# EAGLE design ControlBoard (EAGLE 8.0.1)
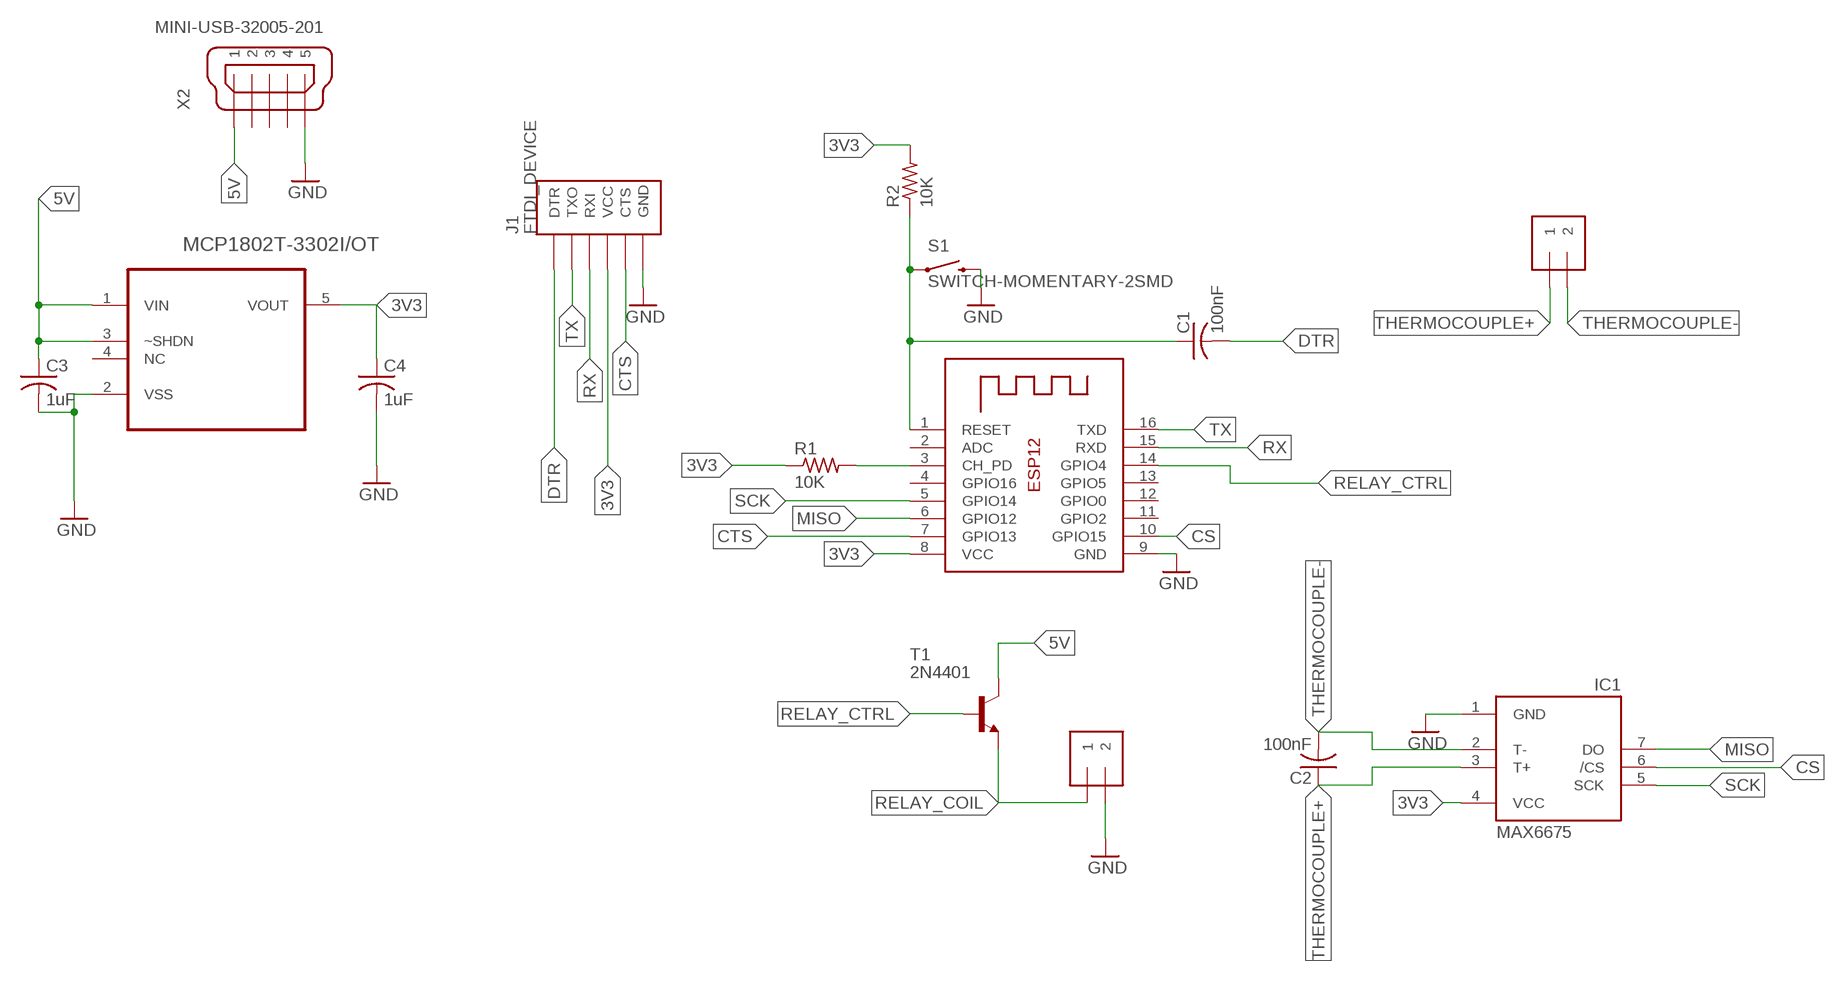
[diagram p0: schematic, sheet 1]

## Parts
C1  100nF  C-USC0603  [C0603]
C2  100nF  C-USC0603  [C0603]
C3  1uF  C-USC0603  [C0603]
C4  1uF  C-USC0603  [C0603]
IC1  MAX6675  [SO08]
J1  FTDI_DEVICE  [FTDI_DEVICE_SIDE]
J2  1X2-3.5MM  [1X2-3.5MM]
J3  1X2-3.5MM  [1X2-3.5MM]
MCP1802T-3302I/OT  MCP1802T-3002I/OT  [SOT95P270X145-5N]
R1  10K  R-US_R0603  [R0603]
R2  10K  R-US_R0603  [R0603]
S1  SWITCH-MOMENTARY-2SMD  [TACTILE-SWITCH-SMD]
T1  2N4401  -NPN-TO92-EBC  [TO92-EBC]
X1  ESP-12  [ESP-12]
X2  MINI-USB-32005-201  [32005-201]

## Nets
3V3: C4.1 IC1.4(VCC) J1.P$4(VCC) MCP1802T-3302I/OT.5(VOUT) R1.1 R2.2 X1.8(VCC)
5V: C3.1 MCP1802T-3302I/OT.1(VIN) MCP1802T-3302I/OT.3(~SHDN) T1.C X2.1
CH_PD: R1.2 X1.3(CH_PD)
CS: IC1.6(/CS) X1.10(GPIO15)
CTS: J1.P$5(CTS) X1.7(GPIO13)
DTR: C1.2 J1.P$1(DTR)
GND: C3.2 C4.2 IC1.1(GND) J1.P$6(GND) J3.2 MCP1802T-3302I/OT.2(VSS) S1.3 X1.9(GND) X2.5
MISO: IC1.7(DO) X1.6(GPIO12)
RELAY_COIL: J3.1 T1.E
RELAY_CTRL: T1.B X1.14(GPIO4)
RST: C1.1 R2.1 S1.1 X1.1(RESET)
RX: J1.P$3(RXI) X1.15(RXD)
SCK: IC1.5(SCK) X1.5(GPIO14)
THERMOCOUPLE+: C2.1 IC1.3(T+) J2.1
THERMOCOUPLE-: C2.2 IC1.2(T-) J2.2
TX: J1.P$2(TXO) X1.16(TXD)
Unconnected: MCP1802T-3302I/OT.4(NC) X1.2(ADC) X1.4(GPIO16) X1.11(GPIO2) X1.12(GPIO0) X1.13(GPIO5) X2.2 X2.3 X2.4

## Library data of the parts
C1-C4 = rcl:C-US: CAPACITOR, American symbol
IC1 = adafruit:MAX6675
J1 = quad:FTDI_DEVICE: Connector which mates to FTDI basic or FTDI cable.
J2 J3 = adafruit:1X2: 3.5mm Terminal block http://www.ladyada.net/library/pcb/eaglelibrary.html
MCP1802T-3302I/OT = quad:MCP1802T-3002I/OT: Low Quiescent Current LDO; MPN: MCP1802T-3002I/OT; OC_FARNELL: 1578373; OC_NEWARK: 54M4837; PACKAGE: SOT-5; SUPPLIER: Microchip
R1 R2 = rcl:R-US_: RESISTOR, American symbol
S1 = quad:SWITCH-MOMENTARY-2: Various NO switches- pushbuttons, reed, etc; PROD_ID: SWCH-08247
T1 = transistor:*-NPN-: NPN Transistror BF959 corrected 2008.03.06
X1 = adafruit:ESP-12
X2 = con-cypressindustries:MINI-USB-: MINI USB-B Conector Source: www.cypressindustries.com; OC_FARNELL: unknown; OC_NEWARK: unknown

## Board
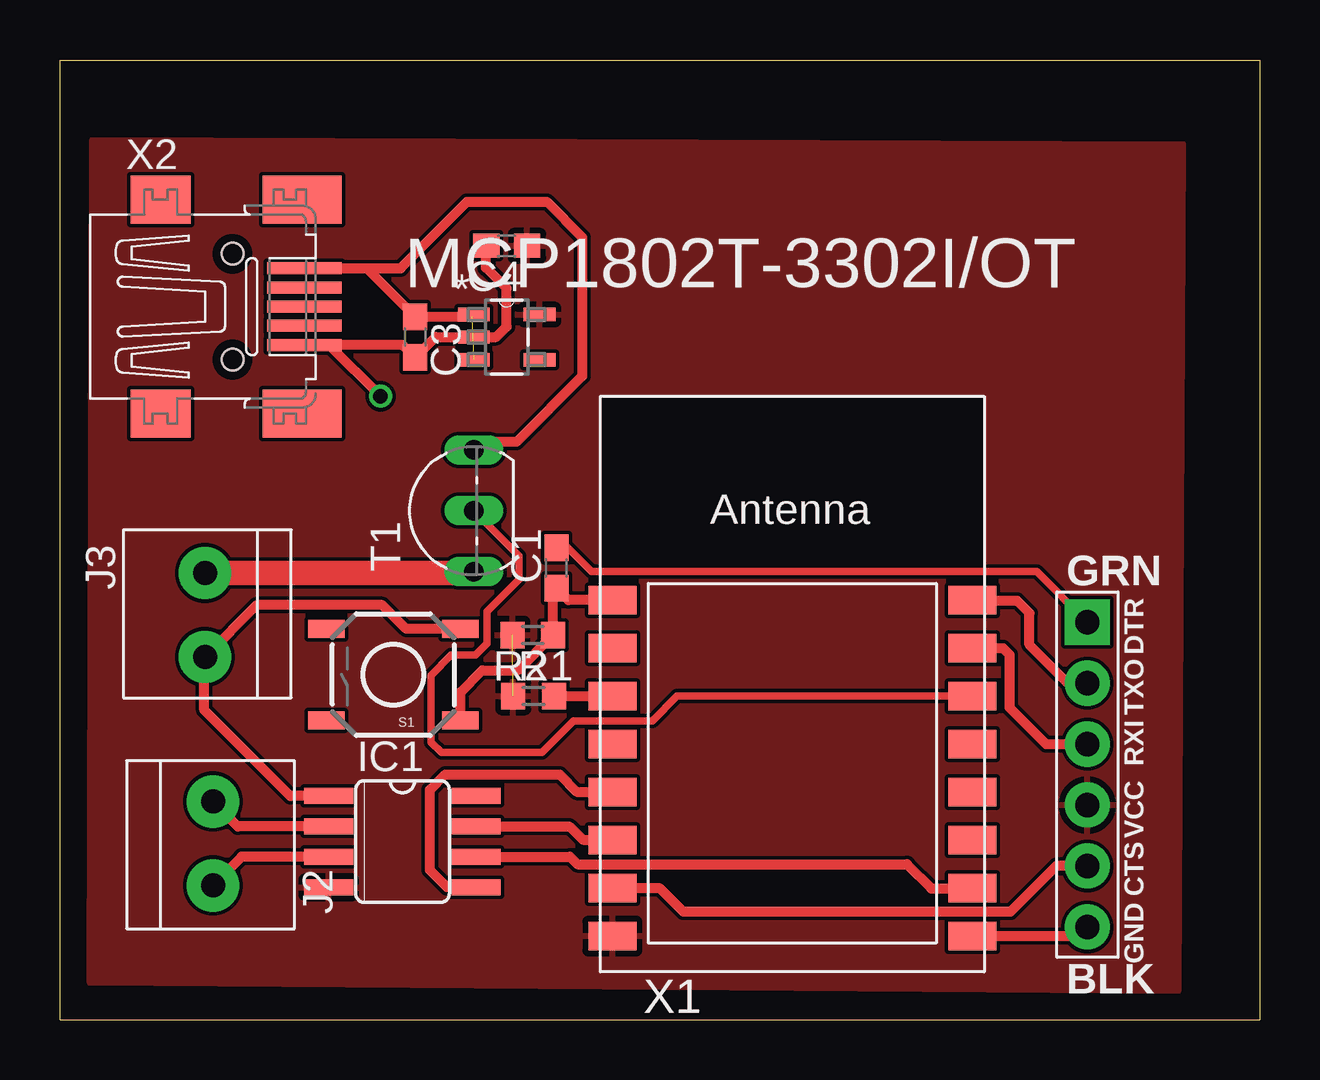
[diagram p1: board, top side]
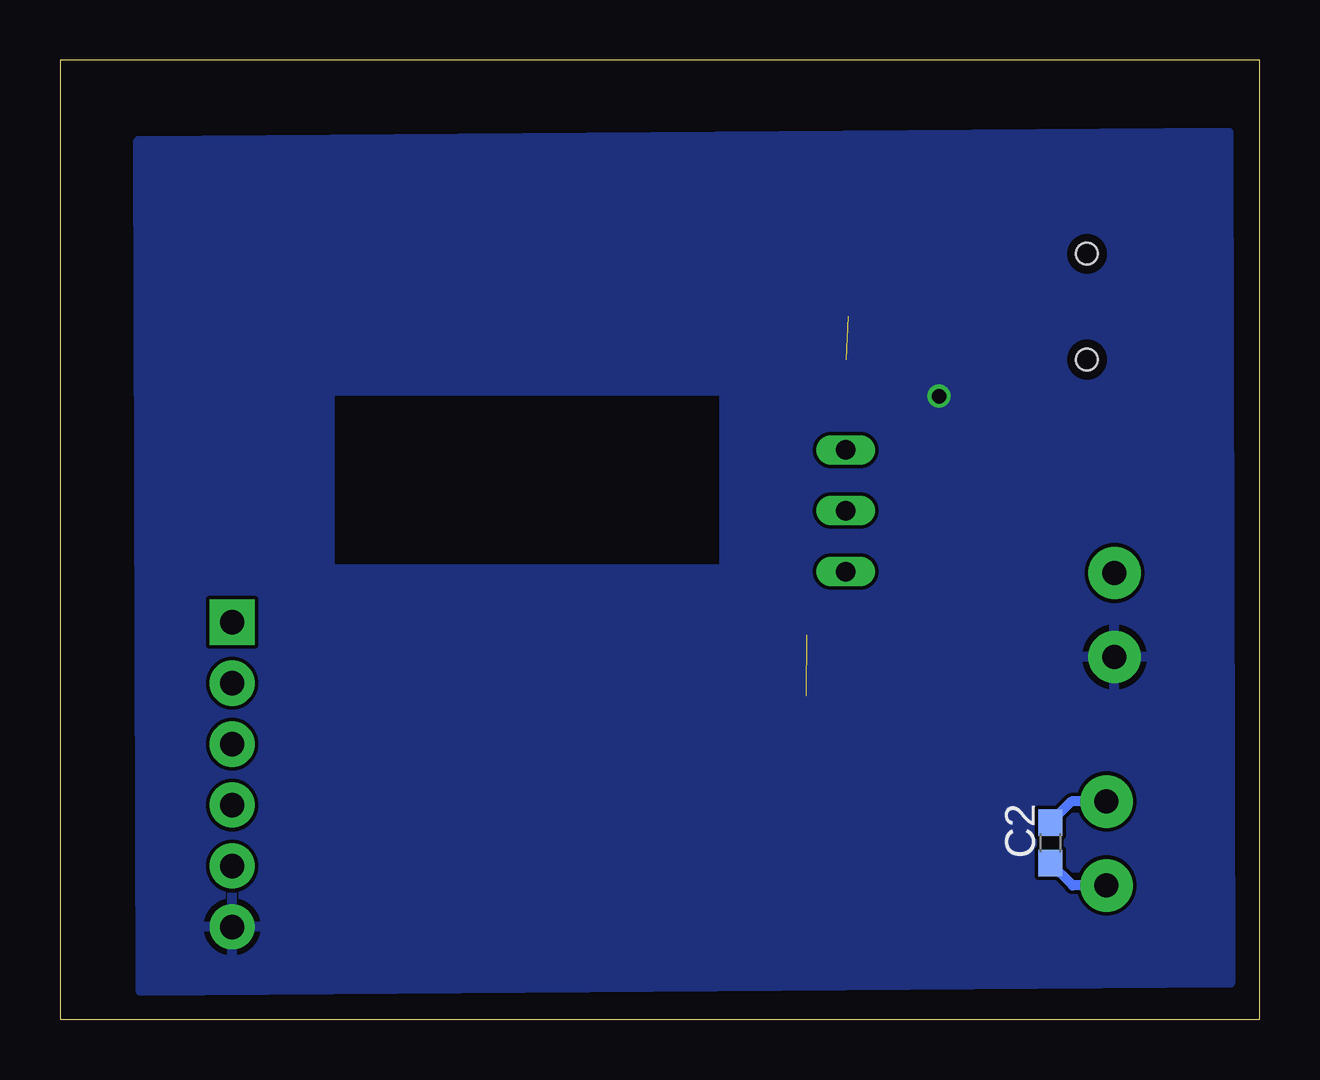
[diagram p2: board, bottom side, seen from below]

Size 50 x 40 mm. Coordinates in mm from the lower left corner, seen from the top.
Outline: 0,0 0,40 50,40 50,0 0,0
Copper layers (1*16): Top 0.0356mm / dielectric 1.5011mm / Bottom 0.0356mm
Design rules "LaenPCBOrder": minimum track width 6mil, minimum drill 13mil, track to track 6mil, track to pad 6mil, pad to pad 6mil, via to via 6mil, smd to smd 6mil, copper to edge 15mil, drill to drill 6mil, minimum pad ring 7mil, minimum via ring 7mil, stop-mask expansion 3mil, vias tented up to drill 0mil, thermal gap 10mil

### Footprints (pad centres in the part's own frame; a part is rotated, then mirrored left to right if it is on the bottom)
C0603 = smd 1.1 x 1: 1 -0.85,0; 2 0.85,0
SO08 = smd 0.66 x 2.032: 1 -1.905,-3.073; 2 -0.635,-3.073; 3 0.635,-3.073; 4 1.905,-3.073; 5 1.905,3.073; 6 0.635,3.073; 7 -0.635,3.073; 8 -1.905,3.073
FTDI_DEVICE_SIDE = drill 1.016 pad 1.88 square: P$1 -6.35,0 | drill 1.016 pad 1.88: P$2 -3.81,0; P$3 -1.27,0; P$4 1.27,0; P$5 3.81,0; P$6 6.35,0
1X2-3.5MM = drill 1 pad 2.184: 1 1.8,0; 2 -1.7,0
SOT95P270X145-5N = smd 1.321 x 0.559: 1 -1.372,0.94; 2 -1.372,0; 3 -1.372,-0.94; 4 1.372,-0.94; 5 1.372,0.94
R0603 = smd 1 x 1.1: 1 -0.85,0; 2 0.85,0
TACTILE-SWITCH-SMD = smd 1.524 x 0.762: 1 -2.794,1.905; 2 2.794,1.905; 3 -2.794,-1.905; 4 2.794,-1.905
TO92-EBC = drill 0.813 long: B 0,-1.27; C 2.54,-1.27; E -2.54,-1.27
ESP-12 = smd 2 x 1.2: 1 -7.5,4.5; 2 -7.5,2.5; 3 -7.5,0.5; 4 -7.5,-1.5; 5 -7.5,-3.5; 6 -7.5,-5.5; 7 -7.5,-7.5; 8 -7.5,-9.5; 9 7.5,-9.5; 10 7.5,-7.5; 11 7.5,-5.5; 12 7.5,-3.5; 13 7.5,-1.5; 14 7.5,0.5; 15 7.5,2.5; 16 7.5,4.5
32005-201 = smd 3.1 x 0.5: 1 3,1.6; 2 3,0.8; 3 3,0; 4 3,-0.8; 5 3,-1.6 | smd 2.5 x 2: M1 -3,-4.45; M2 -3,4.45 | smd 3.3 x 2: M3 2.9,4.45; M4 2.9,-4.45 | hole 0.9: 0,2.2; 0,-2.2

### Placement (x,y rotation side)
C1  20.7,18.82 90 top
C2  8.71,7.37 90 bottom
C3  14.81,28.45 270 top
C4  18.62,32.26 180 top
IC1  14.27,7.42 270 top
J1  42.82,10.21 270 top
J2  6.38,7.39 270 top
J3  6.05,16.81 90 top
MCP1802T-3302I/OT  18.62,28.45 0 top
R1  19.74,13.49 0 top
R2  19.71,16.03 180 top
S1  13.89,14.38 180 top
T1  15.98,21.21 90 top
X1  30.53,12.98 0 top
X2  7.19,29.72 0 top

### Tracks (layer width: path | path; a pad name or v marks a point on that pad's centre or on a via)
3V3  (1 unrouted)
  pour Top: 1.35,36.68 46.81,36.5 46.61,1.17 1.24,1.52
5V  (1 unrouted)
  Top 0.406: X2.1 12.5,31.32 12.79,31.32 | 12.79,31.32 C3.1 17.16,29.3 MCP1802T-3302I/OT.1 | 12.79,31.32 14.2,31.32 16.97,34.09 20.3,34.09 21.77,32.61 21.77,26.82 19.02,24.08 17.58,24.08 T1.C
CH_PD
  Top 0.406: R1.2 X1.3
CS
  Top 0.406: IC1.6 21.26,6.78 21.57,6.48 35.31,6.48 36.32,5.46 38.01,5.46 X1.10
CTS
  Top 0.406: J1.P$5 41.53,6.4 39.62,4.5 25.98,4.5 25.02,5.46 23.05,5.46 X1.7
DTR
  Top 0.305: C1.2 21.15,19.67 22.15,18.67 40.72,18.67 J1.P$1
GND  (via drill 0.6)
  Top 0.406: C4.2 17.75,32.24 17.75,31.34 18.62,30.48 18.62,28.88 18.19,28.45 MCP1802T-3302I/OT.2 15.66,28.45 C3.2 14.29,28.12 X2.5 11.23,28.12 v13.36,25.98 | X1.9 42.44,3.48 J1.P$6 | IC1.1 9.6,9.32 6.02,12.9 6.02,15.09 J3.2 8.2,17.27 13.44,17.27 14.43,16.28 S1.3
  pour Bottom: 46.74,36.63 1.3,36.98 1.22,1.52 46.63,1.17
MISO
  Top 0.406: IC1.7 21.23,8.05 21.79,7.49 23.02,7.49 X1.6
RELAY_COIL
  Top 1.016: J3.1 17.19,18.61 T1.E
RELAY_CTRL
  Top 0.305: X1.14 25.72,13.48 24.69,12.45 21.41,12.45 20.09,11.12 15.9,11.12 15.47,11.56 15.47,14.35 16.31,15.19 17.32,15.19 17.8,15.67 17.8,17.02 19.13,18.34 19.13,19.33 T1.B
RST
  Top 0.406: X1.1 21.19,17.48 C1.1 20.56,17.83 R2.1 19.09,14.55 17.6,14.55 16.69,13.64 S1.1
RX
  Top 0.406: X1.15 39.31,15.48 39.57,15.21 39.57,13.01 41.1,11.48 J1.P$3
SCK
  Top 0.406: IC1.5 16.13,5.51 15.42,6.22 15.42,9.58 16.05,10.21 20.83,10.21 21.54,9.5 23.01,9.5 X1.5
THERMOCOUPLE+
  Top 0.406: IC1.3 7.57,6.78 J2.1
  Bottom 0.406: J2.1 7.79,5.59 C2.1
THERMOCOUPLE-
  Top 0.406: IC1.2 7.42,8.05 J2.2
  Bottom 0.406: J2.2 7.84,9.09 C2.2
TX
  Top 0.406: J1.P$2 42.01,14.02 40.41,15.62 40.41,16.94 39.9,17.45 38.06,17.45 X1.16